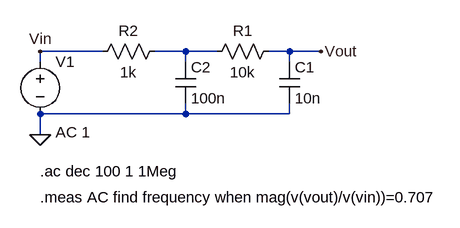
[diagram p0: schematic RC_Low_Pass_Passive_2nd_order2.asc]
RC_Low_Pass_Passive_2nd_order2.asc, the LTspice schematic file:
Version 4
SHEET 1 892 680
WIRE -192 96 -288 96
WIRE -64 96 -112 96
WIRE -16 96 -64 96
WIRE 96 96 64 96
WIRE 144 96 96 96
WIRE -288 112 -288 96
WIRE -64 112 -64 96
WIRE 96 112 96 96
WIRE -64 192 -64 176
WIRE -64 192 -288 192
WIRE 96 192 96 176
WIRE 96 192 -64 192
WIRE -288 224 -288 192
FLAG 144 96 Vout
FLAG -288 224 0
FLAG -288 96 Vin
SYMBOL res 80 80 R90
WINDOW 0 0 56 VBottom 2
WINDOW 3 32 56 VTop 2
SYMATTR InstName R1
SYMATTR Value 10k
SYMBOL voltage -288 96 R0
WINDOW 123 24 124 Left 2
WINDOW 39 0 0 Left 0
SYMATTR Value2 AC 1
SYMATTR InstName V1
SYMATTR Value ""
SYMBOL cap 80 112 R0
SYMATTR InstName C1
SYMATTR Value 10n
SYMBOL res -96 80 R90
WINDOW 0 0 56 VBottom 2
WINDOW 3 32 56 VTop 2
SYMATTR InstName R2
SYMATTR Value 1k
SYMBOL cap -80 112 R0
SYMATTR InstName C2
SYMATTR Value 100n
TEXT -288 280 Left 2 !.ac dec 100 1 1Meg
TEXT -288 320 Left 2 !.meas AC find frequency when mag(v(vout)/v(vin))=0.707

The netlist it stands for:
* RC_Low_Pass_Passive_2nd_order2.asc
R1 Vout N001 10k
V1 Vin 0 AC 1
C1 Vout 0 10n
R2 N001 Vin 1k
C2 N001 0 100n
.ac dec 100 1 1Meg
.meas AC find frequency when mag(v(vout)/v(vin))=0.707
.backanno
.end